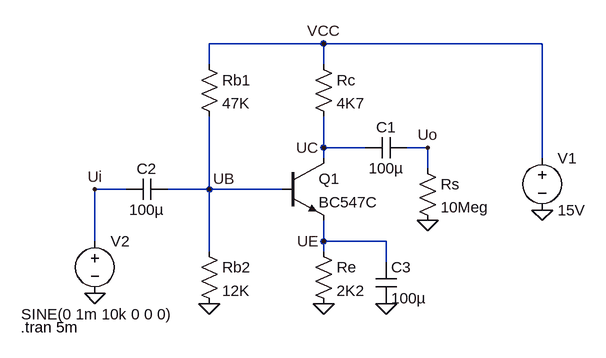
[diagram p0: schematic emitor_comun.asc]
emitor_comun.asc, the LTspice schematic file:
Version 4
SHEET 1 880 680
WIRE 224 0 48 0
WIRE 560 0 224 0
WIRE 48 32 48 0
WIRE 224 32 224 0
WIRE 224 160 224 112
WIRE 288 160 224 160
WIRE 384 160 352 160
WIRE 224 176 224 160
WIRE 560 176 560 0
WIRE 384 192 384 160
WIRE -80 224 -128 224
WIRE 48 224 48 112
WIRE 48 224 -16 224
WIRE 160 224 48 224
WIRE -128 304 -128 224
WIRE 224 304 224 272
WIRE 320 304 224 304
WIRE 48 320 48 224
WIRE 224 320 224 304
WIRE 320 336 320 304
FLAG 48 400 0
FLAG 224 400 0
FLAG 560 256 0
FLAG 224 0 VCC
FLAG 48 224 UB
FLAG 224 160 UC
FLAG 224 304 UE
FLAG -128 384 0
FLAG 384 272 0
FLAG 384 160 Uo
FLAG -128 224 Ui
FLAG 320 400 0
SYMBOL npn 160 176 R0
SYMATTR InstName Q1
SYMATTR Value BC547C
SYMBOL res 32 16 R0
SYMATTR InstName Rb1
SYMATTR Value 47K
SYMBOL res 32 304 R0
SYMATTR InstName Rb2
SYMATTR Value 12K
SYMBOL res 208 16 R0
SYMATTR InstName Rc
SYMATTR Value 4K7
SYMBOL res 208 304 R0
SYMATTR InstName Re
SYMATTR Value 2K2
SYMBOL voltage 560 160 R0
WINDOW 123 0 0 Left 0
WINDOW 39 0 0 Left 0
SYMATTR InstName V1
SYMATTR Value 15V
SYMBOL cap 352 144 R90
WINDOW 0 0 32 VBottom 2
WINDOW 3 32 32 VTop 2
SYMATTR InstName C1
SYMATTR Value 100µ
SYMBOL cap -16 208 R90
WINDOW 0 0 32 VBottom 2
WINDOW 3 32 32 VTop 2
SYMATTR InstName C2
SYMATTR Value 100µ
SYMBOL voltage -128 288 R0
WINDOW 3 -113 128 Left 2
WINDOW 123 0 0 Left 0
WINDOW 39 0 0 Left 0
SYMATTR InstName V2
SYMATTR Value SINE(0 1m 10k 0 0 0)
SYMBOL res 368 176 R0
SYMATTR InstName Rs
SYMATTR Value 10Meg
SYMBOL cap 304 336 R0
SYMATTR InstName C3
SYMATTR Value 100µ
TEXT -242 436 Left 2 !.tran 5m

The netlist it stands for:
* emitor_comun.asc
Q1 UC UB UE 0 BC547C
Rb1 VCC UB 47K
Rb2 UB 0 12K
Rc VCC UC 4K7
Re UE 0 2K2
V1 VCC 0 15V
C1 Uo UC 100µ
C2 UB Ui 100µ
V2 Ui 0 SINE(0 1m 10k 0 0 0)
Rs Uo 0 10Meg
C3 UE 0 100µ
.model NPN NPN
.model PNP PNP
.lib standard.bjt
.tran 5m
.backanno
.end